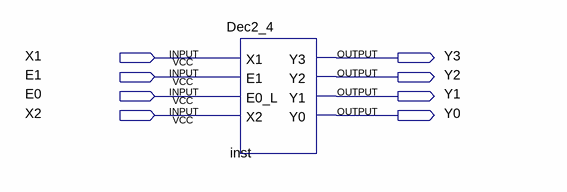
[diagram p0: schematic sheet]
// Quartus schematic DecoderDemo.bdf as structural Verilog: 1 symbols, 8 pins
module DecoderDemo (
  input  X1,
  input  E1,
  input  E0,
  input  X2,
  output Y3,
  output Y2,
  output Y1,
  output Y0
);

  Dec2_4 inst (.X1(X1), .E1(E1), .E0_L(E0), .X2(X2), .Y3(Y3), .Y2(Y2), .Y1(Y1), .Y0(Y0));
endmodule
